# Altium schematic sheet HB_Logic_Power_Controller.SchDoc
size A4; SheetNumber: 14; SheetTotal: 14
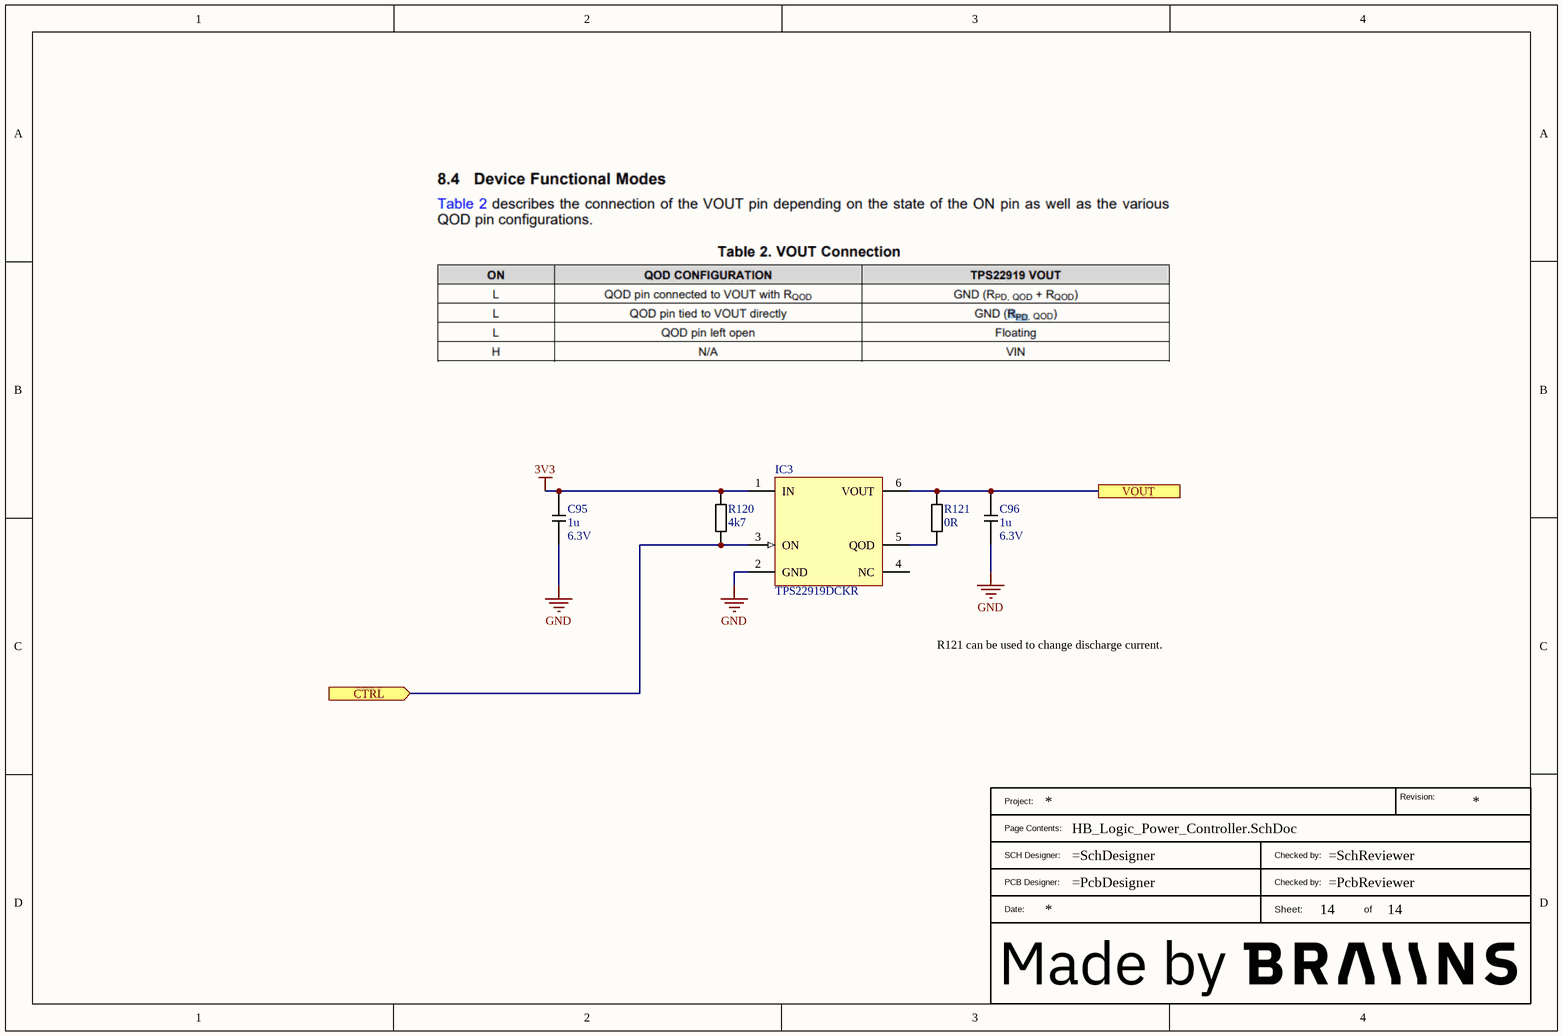
[diagram p0: HB_Logic_Power_Controller.SchDoc]

## Parts
?  BraiinsTitleBlockWithLogo  (value not drawn)  (graphical)
C95  Voltage_Rating: 6.3V  [CAP0402]  (hidden comment: 1u)
C96  Voltage_Rating: 6.3V  [CAP0402]  (hidden comment: 1u)
IC3  TPS22919DCKR  [SC-70]
R120  4k7  [RES0402]
R121  0R  [RES0603]

## Ports
CTRL (in), VOUT

## Nets
3V3: C95.1 IC3.1(IN) R120.2
GND: C95.2 C96.2 IC3.2(GND)
CTRL: IC3.3(ON) R120.1 ; port CTRL
VOUT: C96.1 IC3.6(VOUT) R121.1 ; port VOUT
NetIC3_5: IC3.5(QOD) R121.2

Not connected (* = marked no-connect by the designer): IC3 4(NC)

## Notes on the sheet
- R121 can be used to change discharge current.
- (in symbol BraiinsTitleBlockWithLogo) Revision:; Project:; Page Contents:; SCH Designer:; Checked by:; PCB Designer:; Date:; Sheet:; of

## Library data of the parts
C95 C96 = 30155: CAP CER 1u 10% 6.3V X7R 0402; Part_Type: Capacitor; Part_Status: New; ID: 30155; Updated By: janjuranek; Sorted_Value: 1; Value: 1u; Sub_Type: CER; Manufacturer Part Description: CAP CER 1u 10% 6.3V X7R 0402; Package_Case: 0402; RoHS: Yes; Dielectric: X7R; Tolerance: 10%; Created By: janjuranek; Created_Date: 2023-05-01 19:24:23; Updated_Date: 2023-05-01 19:25:09; ComponentLink1Description: Datasheet; ComponentLink2Description: Supplier Part Details
IC3 = 30187: Self-Protected Load Switch, 5.5 V, 1.5 A, 90-mΩ; Part_Type: IC; Part_Status: New; ID: 30187; Updated By: janjuranek; Value: TPS22919DCKR; Manufacturer Part Number: TPS22919DCKR; Manufacturer Part Description: Self-Protected Load Switch, 5.5 V, 1.5 A, 90-mΩ; Package_Case: SC-70; RoHS: Yes; Created By: janjuranek; Created_Date: 2023-05-26 10:45:28; Updated_Date: 2023-05-26 10:46:59; ComponentLink1Description: Datasheet; ComponentLink2Description: Supplier Part Details
R120 = 30073: RES 4k7 Ohm 1% 0402; Part_Status: New; ID: 30073; Updated By: Jan; Sorted_Value: 4; Value: 4k7; Part_Type: Resistor; Manufacturer Part Description: RES 4k7 Ohm 1% 0402; Package_Case: 0402; RoHS: Yes; Temperature Range: -40 to +150C; Tolerance: 1%; Created By: Jan; Created_Date: 2023-03-02 13:15:12; Updated_Date: 2023-03-02 13:15:46; ComponentLink1Description: Datasheet; ComponentLink2Description: Supplier Part Details
R121 = 30097: RES 0R Ohm 1% 0603; Part_Status: New; ID: 30097; Updated By: janjuranek; Sorted_Value: 0; Value: 0R; Part_Type: Resistor; Manufacturer Part Description: RES 0R Ohm 1% 0603; Package_Case: 0603; RoHS: Yes; Tolerance: 1%; Created By: janjuranek; Created_Date: 2023-03-07 17:09:44; Updated_Date: 2023-03-07 22:04:59; ComponentLink1Description: Datasheet; ComponentLink2Description: Supplier Part Details